# Altium project RS232_RS485_CANS6.PrjPcb
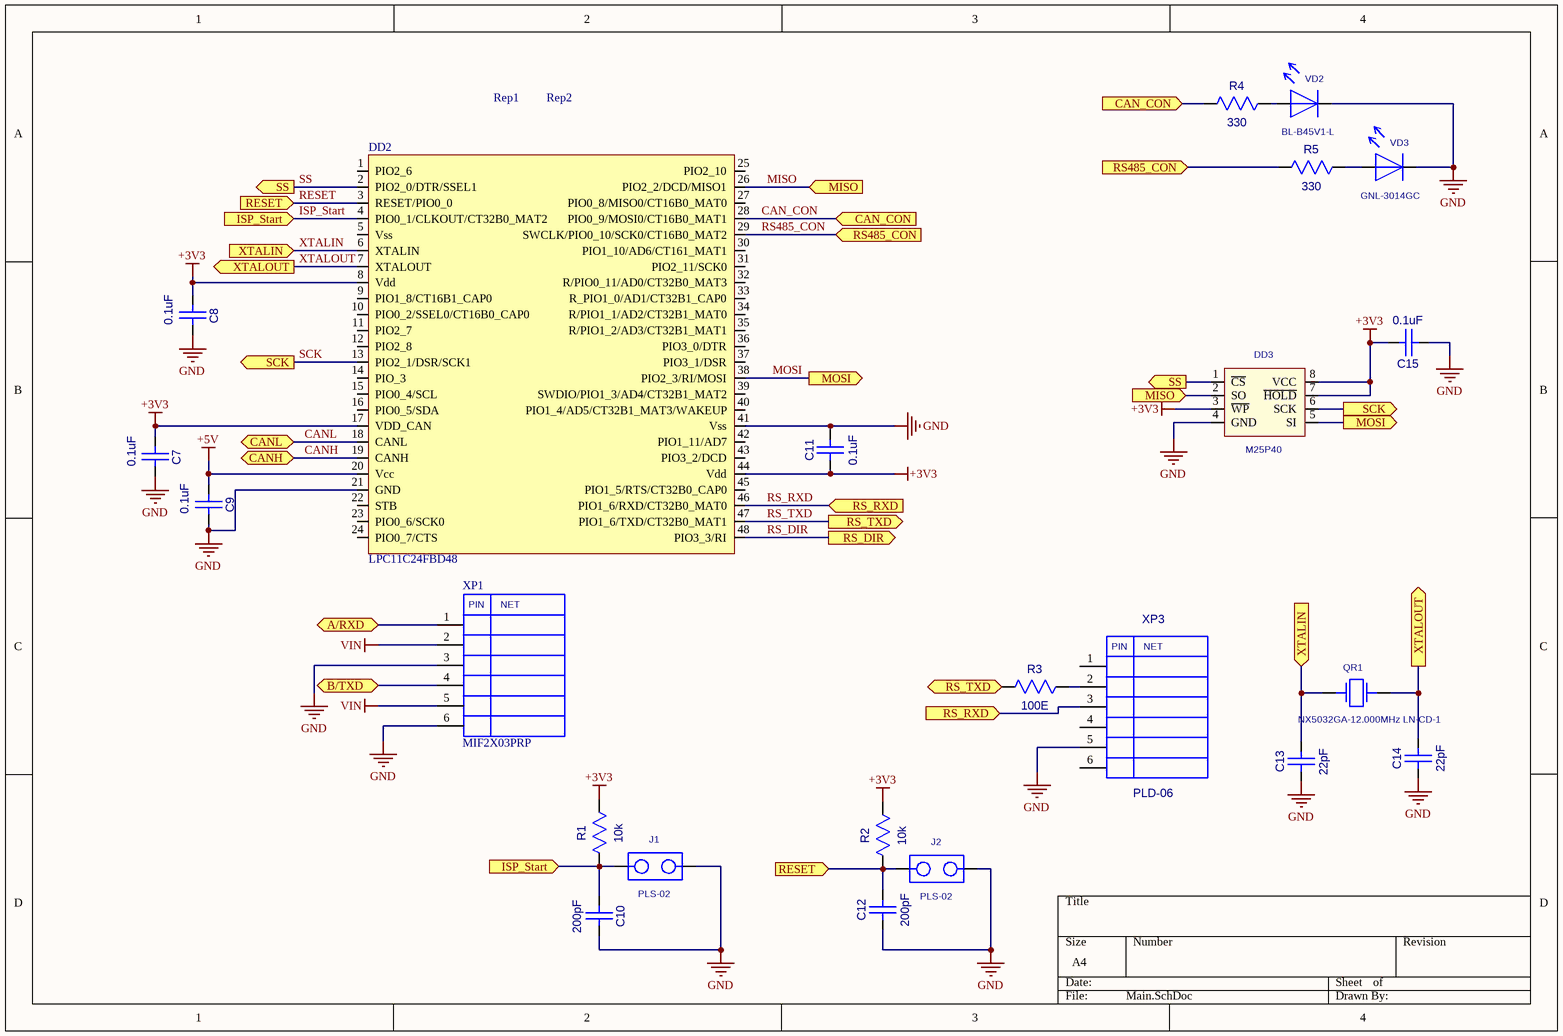
[diagram p0: Main.SchDoc]
3 sheets, 73 parts. Net scope: flat (ports and power ports of the same name join across sheets).
Board file: RS232_RS485_CANS6.PcbDoc
Sheets:
  Main.SchDoc
  Power.SchDoc
  Interfaces.SchDoc

## Sheet Main.SchDoc
size A4

### Parts
C7  0.1uF  [CC0603-3M]
C8  0.1uF  [CC0603-3M]
C9  0.1uF  [CC0603-3M]
C10  200pF  [CC0603-3M]
C11  0.1uF  [CC0603]
C12  200pF  [CC0603-3M]
C13  22pF  [CC0603-3M]
C14  22pF  [CC0603-3M]
C15  0.1uF  [CC0603-3M]
DD2  LPC11C24FBD48  [LQFP48]
DD3  M25P40  [EIAJ_SO8]
J1  PLS-02  [PLS-02]
J2  PLS-02  [PLS-02]
QR1  NX5032GA-12.000MHz LN-CD-1  [AC5032_2]
R1  10k  [RC0603-3M]
R2  10k  [RC0603-3M]
R3  100E  [RC0603-3M]
R4  330  [RC0603-3M]
R5  330  [RC0603-3M]
Rep1  REPER1.2  [REPER1.2]  (value not drawn)
Rep2  REPER1.2  [REPER1.2]  (value not drawn)
VD2  BL-B45V1-L  [LED3]
VD3  GNL-3014GC  [LED3]
XP1  MIF2X03PRP  [MIF2X03PRP]
XP3  PLD-06  [PIN6]

### Ports
A/RXD, B/TXD, CAN_CON (in), CANH, CANL, ISP_Start (in), MISO (in), MOSI (out), RESET (in), RS485_CON (in), RS_DIR (out), RS_RXD (in), RS_TXD (out), SCK (out), SS (out), XTALIN (in), XTALOUT (out)

### Nets
+3V3: C7.1(A) C8.1(A) C11.1(A) C15.2(B) DD2.8(Vdd) DD2.17(VDD_CAN) DD2.44(Vdd) DD3.3(~{WP}) DD3.7(~{HOLD}) DD3.8(VCC) R1.2(B) R2.2(B)
+5V: C9.1(A) DD2.20(Vcc)
GND: C7.2(B) C8.2(B) C9.2(B) C10.2(B) C11.2(B) C12.1(A) C13.1(A) C14.1(A) C15.1(A) DD2.21(GND) DD2.41(Vss) DD3.4(GND) J1.2 J2.2 VD2.1 VD3.1 XP1.3 XP1.6 XP3.5
VIN: XP1.2 XP1.5
A/RXD: XP1.1 ; port A/RXD
B/TXD: XP1.4 ; port B/TXD
CAN_CON: DD2.28(PIO0_9/MOSI0/CT16B0_MAT1) R4.1(A) ; port CAN_CON
CANH: DD2.19(CANH) ; port CANH
CANL: DD2.18(CANL) ; port CANL
ISP_Start: C10.1(A) DD2.4(PIO0_1/CLKOUT/CT32B0_MAT2) J1.1 R1.1(A) ; port ISP_Start
MISO: DD2.26(PIO2_2/DCD/MISO1) DD3.2(SO) ; port MISO
MOSI: DD2.38(PIO2_3/RI/MOSI) DD3.5(SI) ; port MOSI
RESET: C12.2(B) DD2.3(RESET/PIO0_0) J2.1 R2.1(A) ; port RESET
RS485_CON: DD2.29(SWCLK/PIO0_10/SCK0/CT16B0_MAT2) R5.1(A) ; port RS485_CON
RS_DIR: DD2.48(PIO3_3/RI) ; port RS_DIR
RS_RXD: DD2.46(PIO1_6/RXD/CT32B0_MAT0) XP3.3 ; port RS_RXD
RS_TXD: DD2.47(PIO1_6/TXD/CT32B0_MAT1) R3.1(A) ; port RS_TXD
SCK: DD2.13(PIO2_1/DSR/SCK1) DD3.6(SCK) ; port SCK
SS: DD2.2(PIO2_0/DTR/SSEL1) DD3.1(~{CS}) ; port SS
XTALIN: C13.2(B) DD2.6(XTALIN) QR1.1 ; port XTALIN
XTALOUT: C14.2(B) DD2.7(XTALOUT) QR1.2 ; port XTALOUT
NetR3_2: R3.2(B) XP3.2
NetR4_2: R4.2(B) VD2.2
NetR5_2: R5.2(B) VD3.2

Not connected (* = marked no-connect by the designer): DD2 1(PIO2_6) 5(Vss) 9(PIO1_8/CT16B1_CAP0) 10(PIO0_2/SSEL0/CT16B0_CAP0) 11(PIO2_7) 12(PIO2_8) 14(PIO_3) 15(PIO0_4/SCL) 16(PIO0_5/SDA) 22(STB) 23(PIO0_6/SCK0) 24(PIO0_7/CTS) 25(PIO2_10) 27(PIO0_8/MISO0/CT16B0_MAT0) 30(PIO1_10/AD6/CT161_MAT1) 31(PIO2_11/SCK0) 32(R/PIO0_11/AD0/CT32B0_MAT3) 33(R_PIO1_0/AD1/CT32B1_CAP0) 34(R/PIO1_1/AD2/CT32B1_MAT0) 35(R/PIO1_2/AD3/CT32B1_MAT1) 36(PIO3_0/DTR) 37(PIO3_1/DSR) 39(SWDIO/PIO1_3/AD4/CT32B1_MAT2) 40(PIO1_4/AD5/CT32B1_MAT3/WAKEUP) 42(PIO1_11/AD7) 43(PIO3_2/DCD) 45(PIO1_5/RTS/CT32B0_CAP0); Rep1 1; Rep2 1; XP3 1 4 6

### Notes on the sheet
- (in symbol MIF2X03PRP) PIN; NET
- (in symbol PLD-06) PIN; NET

### Library data of the parts
C7-C15 = CC0603
  C7-C9 C11 C15: Value: 0.1uF
  C10 C12: Value: 200pF
  C13 C14: Value: 22pF
DD3 = S25FL016A0LMFI01: Value: M25P40
QR1 = AC5032_2: AC5032/2; Value: NX5032GA-12.000MHz LN-CD-1
R1-R5 = RC0603
  R1 R2: Value: 10k
  R3: Value: 100E
  R4 R5: Value: 330
VD2 VD3 = LED_3
  VD2: Value: BL-B45V1-L
  VD3: Value: GNL-3014GC
XP3 = PLD-06: PLD06; Value: *
DD2 = LPC11C24FBD48: Value: LPC11C24FBD48
J1 J2 = PLS-02: Value: PLS-02
Rep1 Rep2 = REPER1.2: Value: *
XP1 = MIF2X03PRP: Value: *

## Sheet Power.SchDoc
size A4
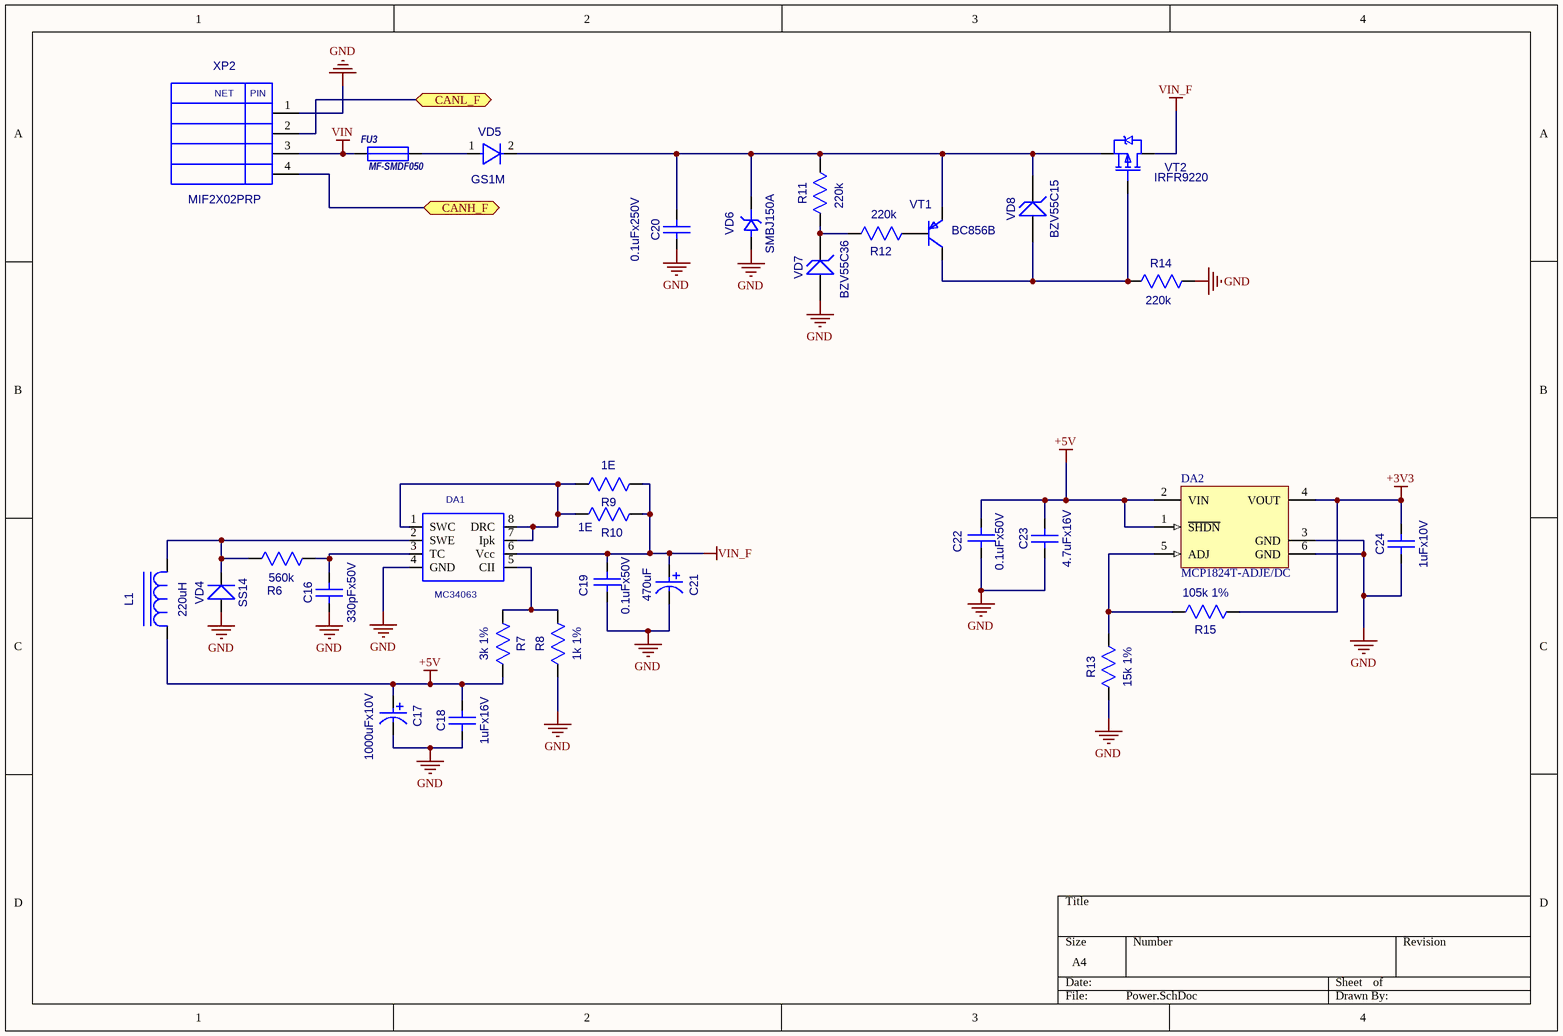
[diagram p1: Power.SchDoc]

### Parts
C16  330pFx50V  [CC0603-3M]
C17  1000uFx10V  [CC8X3.5]
C18  1uFx16V  [CC0603-3M]
C19  0.1uFx50V  [CC0603-3M]
C20  0.1uFx250V  [CC1206-MIDI]
C21  470uF  [CC16X10_CAP0.5(1)(Primary)]
C22  0.1uFx50V  [CC0603-3M]
C23  4.7uFx16V  [CC0805-MIDI-2M1]
C24  1uFx10V  [CC0603-3M]
DA1  MC34063  [SO-8]
DA2  MCP1824T-ADJE/DC  [SOT223-6]
FU3  MF-SMDF050  [MF-SMDF]
L1  220uH  [SDR0805]
R6  560k  [RC0603-3M]
R7  3k 1%  [RC0603-3M]
R8  1k 1%  [RC0603-3M]
R9  1E  [RC0805_IPC_NOM]
R10  1E  [RC0805_IPC_NOM]
R11  220k  [RC1206-2M]
R12  220k  [RC1206-2M]
R13  15k 1%  [RC0603-3M]
R14  220k  [RC1206-2M]
R15  105k 1%  [RC0603-3M]
VD4  SS14  [SMA]
VD5  GS1M  [SMA]
VD6  SMBJ150A  [SMB]
VD7  BZV55C36  [SOD-80]
VD8  BZV55C15  [SOD-80]
VT1  BC856B  [SOT-23(123)]
VT2  IRFR9220  [D-PAK(TO-252AA)]
XP2  MIF2X02PRP  [MIF2X02PRP]

### Ports
CANH_F, CANL_F

### Nets
+3V3: C24.2(B) DA2.4(VOUT) R15.1(A)
+5V: C17.1 C18.2(B) C22.1(A) C23.2(B) DA2.1(~{SHDN}) DA2.2(VIN) L1.1(C) R7.2(B)
GND: C16.1(A) C17.2 C18.1(A) C19.2(B) C20.1(A) C21.1 C22.2(B) C23.1(A) C24.1(A) DA1.4(GND) DA2.3(GND) DA2.6(GND) R8.1(A) R13.1(A) R14.2(B) VD4.1(A) VD6.1(A) VD7.1(A) XP2.1
VIN: FU3.1 XP2.3
VIN_F: C19.1(A) C21.2 DA1.6(Vcc) R9.1(A) R10.1(A) VT2.3(D)
CANHF: XP2.4 ; port CANH_F
CANLF: XP2.2 ; port CANL_F
NetC16_2: C16.2(B) DA1.3(TC) R6.2(B)
NetC20_2: C20.2(B) R11.2(B) VD5.2(K) VD6.2(K) VD8.2 VT1.2(E) VT2.2(S)
NetDA1_1: DA1.1(SWC) DA1.7(Ipk) DA1.8(DRC) R9.2(B) R10.2(B)
NetDA1_2: DA1.2(SWE) L1.2(A) R6.1(A) VD4.2(K)
NetDA1_5: DA1.5(CII) R7.1(A) R8.2(B)
NetDA2_5: DA2.5(ADJ) R13.2(B) R15.2(B)
NetFU3_2: FU3.2 VD5.1(A)
NetR11_1: R11.1(A) R12.2(B) VD7.2
NetR12_1: R12.1(A) VT1.1(B)
NetR14_1: R14.1(A) VD8.1(A) VT1.3(C) VT2.1(G)

### Notes on the sheet
- (in symbol MIF2X02PRP) NET; PIN

### Library data of the parts
C16 C18 C19 C22 C24 = CC0603
  C16: Value: 330pFx50V
  C18: Value: 1uFx16V
  C19 C22: Value: 0.1uFx50V
  C24: Value: 1uFx10V
C17 = CAP0.35: Value: 1000uFx10V
C20 = CC1206: Value: 0.1uFx250V
C21 = CAP0.5(1): Value: 470uF
C23 = CC0805: Value: 4.7uFx16V
DA2 = MCP1824T-ADJE/DC: 300 mA, Low Voltage, Low Quiescent Current LDO Regulator, 5-Pin SOT-223, Extended Temperature, Tape and Reel; Published: 29-Jan-2009; DatasheetVersion: revA, Aug-2007; PackageVersion: revAW, Oct-2008; PackageReference: SOT-223-DC5; Publisher: Altium Limited; PackageDescription: 5-Lead Plastic Small Outline Transistor (DC) [SOT-223]; ComponentLink1Description: Manufacturer Link; ComponentLink1URL: http://www.microchip.com; ComponentLink2Description: Datasheet; ComponentLink2URL: http://ww1.microchip.com/downloads/en/DeviceDoc/22070a.pdf; ComponentLink3Description: Packaging Specification; ComponentLink3URL: http://ww1.microchip.com/downloads/en/PackagingSpec/00049AW.pdf
FU3 = MF-SMDF: Value: MF-SMDF050
L1 = SDR0805: Value: 220uH
R6-R8 R13 R15 = RC0603
  R6: Value: 560k
  R7: Value: 3k 1%
  R8: Value: 1k 1%
  R13: Value: 15k 1%
  R15: Value: 105k 1%
R9 R10 = RC0805: Value: 1E
R11 R12 R14 = RC1206: Value: 220k
VD4 = SS14: Schottky Rectifier; Value: SS14
VD5 = GS1M: Value: {Value}
VD6 = SMBJ: Value: SMBJ150A
VD7 VD8 = BZV55C12: Zener Voltage Regulator Diode; OriginalName: BZX84C10LT1; ComponentField6: Pin 2 is not connected and not drawn.; ComponentField7: Published 29-Sep-2000
  VD7: Value: BZV55C36
  VD8: Value: BZV55C15
VT1 = BC856B: OriginalName: BC856BLT; ComponentField7: Published 29-Sep-2000; Value: BC856B
VT2 = IRFR9220: HEXFET Power MOSFET; OriginalName: IRLML5103; ComponentField7: Published 8-Jun-2000; Value: IRFR9220
DA1 = MC34063: Value: *
XP2 = MIF2X02PRP: Value: *

## Sheet Interfaces.SchDoc
size A4
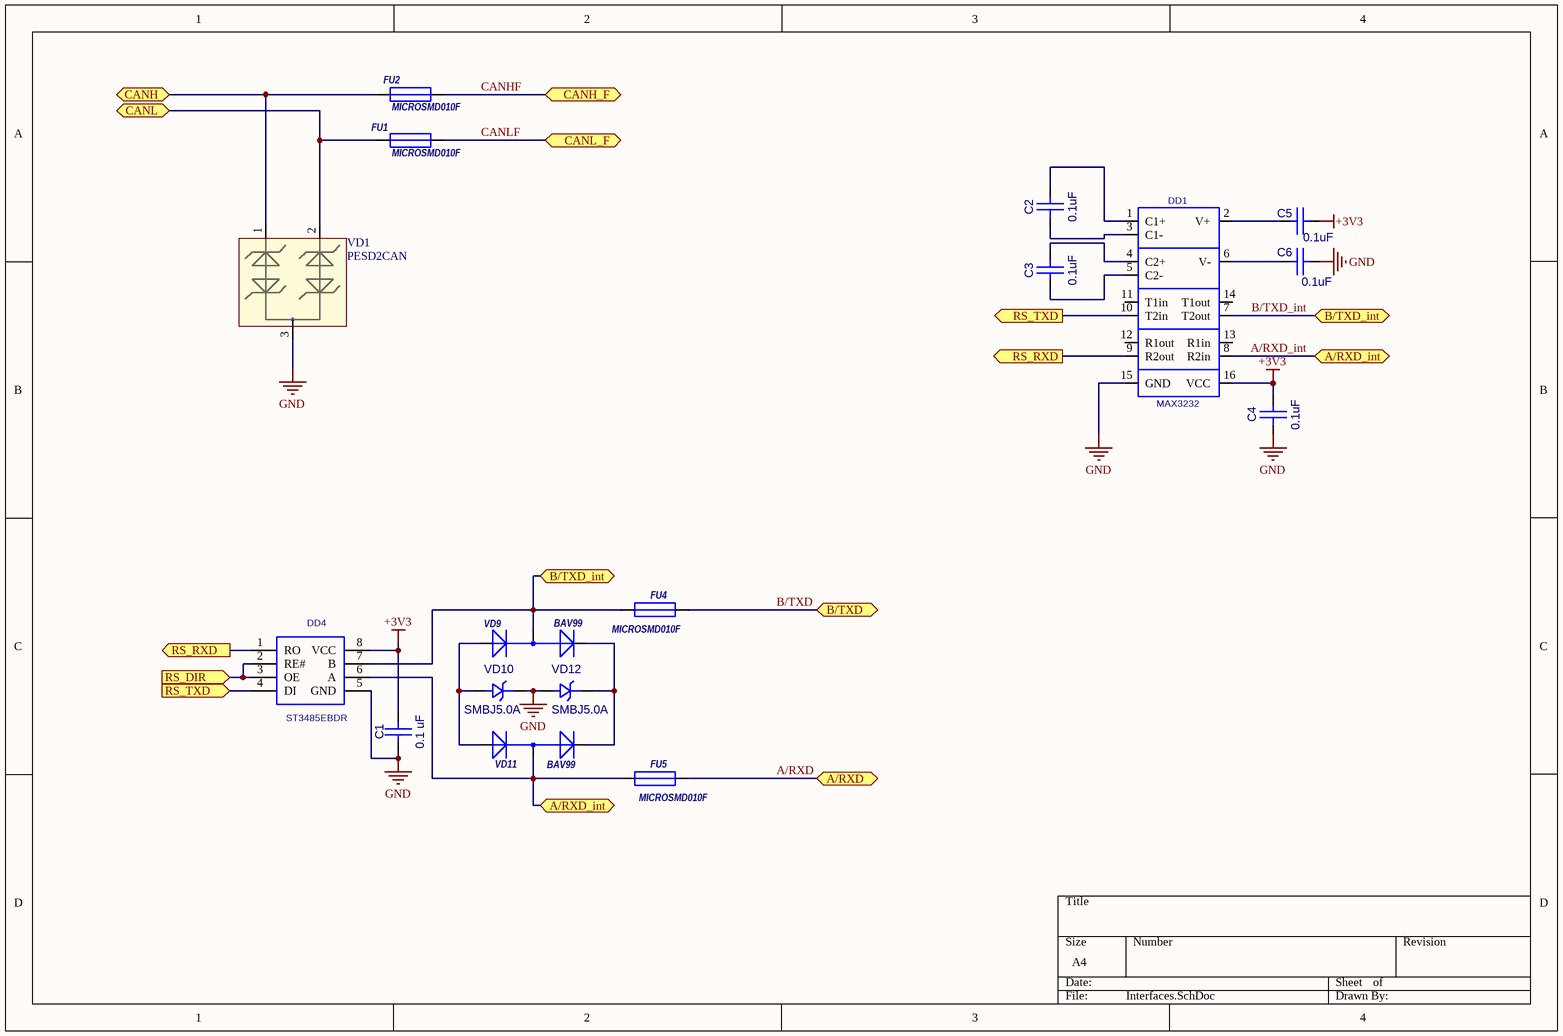
[diagram p2: Interfaces.SchDoc]

### Parts
C1  0.1 uF  [CC0603-3M]
C2  0.1uF  [CC0603-3M]
C3  0.1uF  [CC0603-3M]
C4  0.1uF  [CC0603-3M]
C5  0.1uF  [CC0603-3M]
C6  0.1uF  [CC0603-3M]
DD1  MAX3232  [SO16_M]
DD4  ST3485EBDR  [SO-8]
FU1  MICROSMD010F  [RC1210]
FU2  MICROSMD010F  [RC1210]
FU4  MICROSMD010F  [RC1210]
FU5  MICROSMD010F  [RC1210]
VD1  PESD2CAN  [SOT-23(123)]
VD9  BAV99  [SOT-23(GSD)]
VD10  SMBJ5.0A  [SMB]
VD11  BAV99  [SOT-23(GSD)]
VD12  SMBJ5.0A  [SMB]

### Ports
A/RXD, A/RXD_int, B/TXD, B/TXD_int, CANH, CANH_F, CANL, CANL_F, RS_DIR (in), RS_RXD (out), RS_TXD (in), RS_TXD (out)

### Nets
+3V3: C1.2(B) C4.2(B) C5.1(A) DD1.16(VCC) DD4.8(VCC)
GND: C1.1(A) C4.1(A) C6.1(A) DD1.15(GND) DD4.5(GND) VD1.3 VD10.2(K) VD12.1(A)
A/RXD: FU5.1 ; port A/RXD
A/RXD_int: DD1.8(R2in) DD4.6(A) FU5.2 VD11.3(AK) ; port A/RXD_int
B/TXD: FU4.1 ; port B/TXD
B/TXD_int: DD1.7(T2out) DD4.7(B) FU4.2 VD9.3(AK) ; port B/TXD_int
CANH: FU2.1 VD1.1 ; port CANH
CANHF: FU2.2 ; port CANH_F
CANL: FU1.1 VD1.2 ; port CANL
CANLF: FU1.2 ; port CANL_F
RS_DIR: DD4.2(RE#) DD4.3(OE) ; port RS_DIR
RS_RXD: DD1.9(R2out) DD4.1(RO) ; port RS_RXD
RS_TXD: DD1.10(T2in) DD4.4(DI) ; port RS_TXD
NetC2_1: C2.1(A) DD1.3(C1-)
NetC2_2: C2.2(B) DD1.1(C1+)
NetC3_1: C3.1(A) DD1.5(C2-)
NetC3_2: C3.2(B) DD1.4(C2+)
NetC5_2: C5.2(B) DD1.2(V+)
NetC6_2: C6.2(B) DD1.6(V-)
NetVD9_1: VD9.1(A) VD10.1(A) VD11.1(A)
NetVD9_2: VD9.2(K) VD11.2(K) VD12.2(K)

Not connected (* = marked no-connect by the designer): DD1 11(T1in) 12(R1out) 13(R1in) 14(T1out)

### Library data of the parts
C1-C6 = CC0603
  C1: Value: 0.1 uF
  C2-C6: Value: 0.1uF
DD1 = ST232BD/CD: Value: MAX3232
DD4 = SP485: Value: *
FU1 FU2 FU4 FU5 = MICROSMD: Value: MICROSMD010F
VD1 = PESD2CAN: TVS for CAN
VD9 VD11 = BAV99: 1.0 Ampere General Purpose Rectifier; ComponentField6: Published 8-Jun-2000, Modified 11-July-2000: SIM Model Added.; Value: *
VD10 VD12 = SMBJ: Value: *

## Nets that join several sheets
+3V3: Main (12 pins), Power (C24.2 DA2.4 R15.1), Interfaces (5 pins)
+5V: Main (C9.1 DD2.20), Power (8 pins)
GND: Main (19 pins), Power (19 pins), Interfaces (8 pins)
VIN: Main (XP1.2 XP1.5), Power (FU3.1 XP2.3)
A/RXD: Main (XP1.1), Interfaces (FU5.1)
B/TXD: Main (XP1.4), Interfaces (FU4.1)
CANH: Main (DD2.19), Interfaces (FU2.1 VD1.1)
CANHF: Power (XP2.4), Interfaces (FU2.2)
CANL: Main (DD2.18), Interfaces (FU1.1 VD1.2)
CANLF: Power (XP2.2), Interfaces (FU1.2)
RS_DIR: Main (DD2.48), Interfaces (DD4.2 DD4.3)
RS_RXD: Main (DD2.46 XP3.3), Interfaces (DD1.9 DD4.1)
RS_TXD: Main (DD2.47 R3.1), Interfaces (DD1.10 DD4.4)